# EAGLE design rgbstripe_msgeq7_pcb (EAGLE 9.6.2)
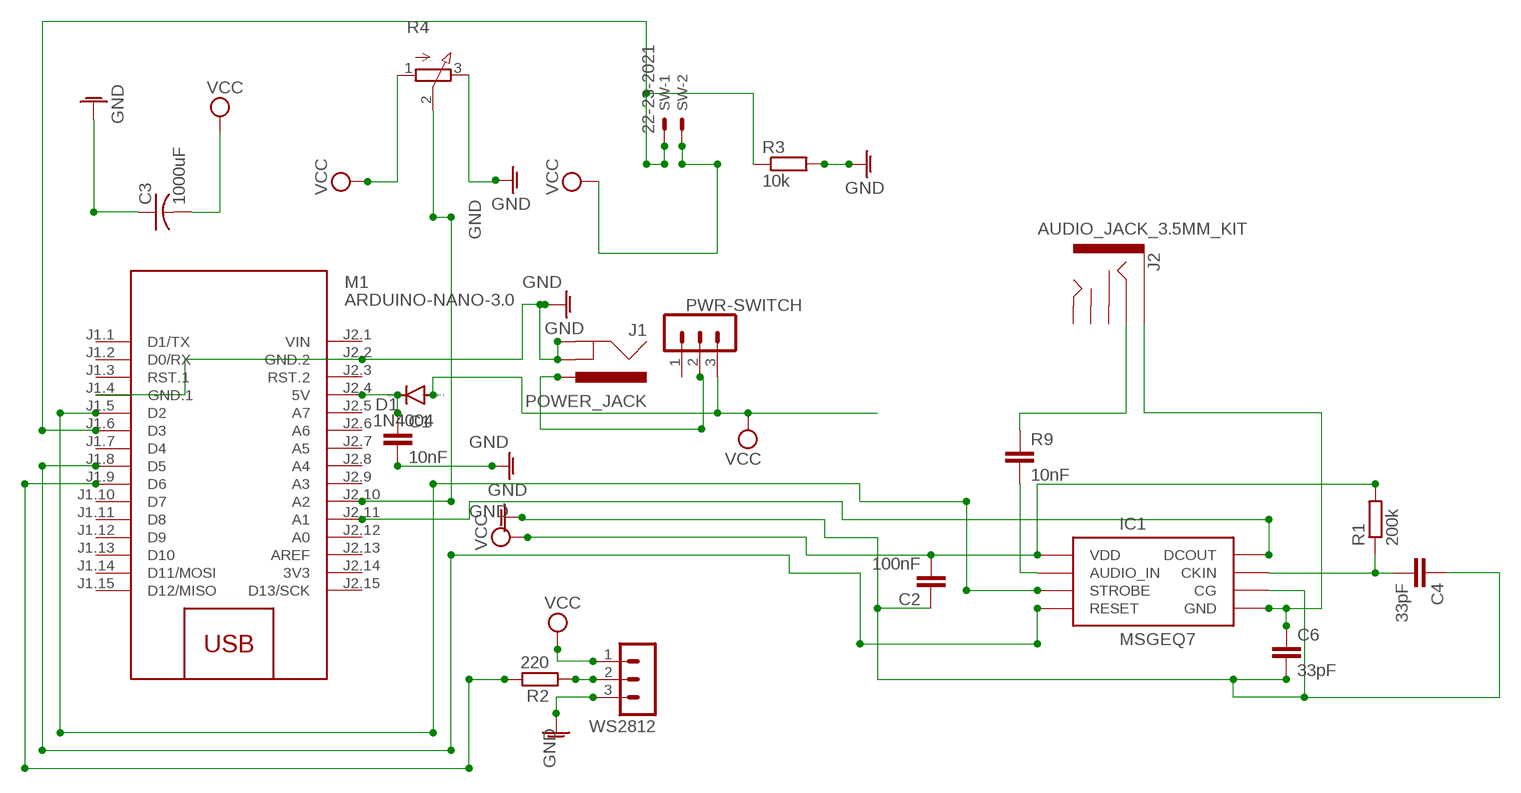
[diagram p0: schematic, sheet 1]

## Parts
C1  10nF  C-EU025-025X050  [C025-025X050]
C2  100nF  C-EU025-025X050  [C025-025X050]
C3  1000uF  C-US050-024X044  [C050-024X044]
C4  33pF  C-EU025-025X050  [C025-025X050]
C6  33pF  C-EU025-025X050  [C025-025X050]
D1  1N4004  [DO41-10]
IC1  MSGEQ7P  MSGEQ7DIL  [DIP08]
J1  POWER_JACK  [POWER_JACK_PTH]
J2  AUDIO_JACK_3.5MM_KIT  [AUDIO-JACK-KIT]
M1  ARDUINO-NANO-3.0  [ARDUINO-NANO-3.0]
PWR-SWITCH  MA03-1  [MA03-1]
R1  200k  R-EU_0204/5  [0204/5]
R2  220  R-EU_0204/5  [0204/5]
R3  10k  R-EU_0204/5  [0204/5]
R4  3RP/1610N  [3RP/1610N]
R9  10nF  C-EU025-025X050  [C025-025X050]
SW  22-23-2021  [22-23-2021]
WS2812  MA03-1  [MA03-1]

## Nets
GND: C1.2 C2.1 C3.1 C4.1 C6.2 IC1.6(CG) J1.GND J1.GNDBREAK M1.J1.4(GND.1) M1.J2.2(GND.2) R3.2 R4.3(E) WS2812.3
N$1: C1.1 D1.C M1.J2.4(5V)
N$2: IC1.7(RESET) M1.J1.8(D5)
N$3: IC1.3(DCOUT) M1.J2.11(A1)
N$8: IC1.4(STROBE) M1.J1.5(D2)
N$10: J2.RING R9.1
N$11: C4.2 IC1.8(CKIN) R1.1
N$12: C6.1 IC1.2(GND) J2.SLEEVE
N$13: IC1.5(AUDIO_IN) R9.2
N$14: M1.J1.9(D6) R2.2
N$15: M1.J2.10(A2) R4.2(S)
N$16: R2.1 WS2812.2
N$17: M1.J1.6(D3) R3.1 SW.1
N$19: J1.PWR PWR-SWITCH.2
VCC: C2.2 C3.2 D1.A IC1.1(VDD) PWR-SWITCH.3 R1.2 R4.1(A) SW.2 WS2812.1
Unconnected: J2.RSH J2.TIP J2.TSH M1.J1.1(D1/TX) M1.J1.2(D0/RX) M1.J1.3(RST.1) M1.J1.7(D4) M1.J1.10(D7) M1.J1.11(D8) M1.J1.12(D9) M1.J1.13(D10) M1.J1.14(D11/MOSI) M1.J1.15(D12/MISO) M1.J2.3(RST.2) M1.J2.5(A7) M1.J2.6(A6) M1.J2.7(A5) M1.J2.8(A4) M1.J2.9(A3) M1.J2.12(A0) M1.J2.13(AREF) M1.J2.15(D13/SCK) PWR-SWITCH.1

## Power pins joined to a net without a drawn wire
3V3: M1.J2.14(3V3)
VIN: M1.J2.1(VIN)

## Library data of the parts
C1 C2 C4 C6 R9 = resistor:C-EU: CAPACITOR, European symbol
C3 = resistor:C-US: CAPACITOR, American symbol
D1 = diode:1N4004: DIODE general purpose rectifier, 1 A
IC1 = SparkFun-IC-Special-Function:MSGEQ7: 7-band graphic equalizer This IC is for making a 7 band/channel audio spectrometer. There are two versions of this part. The DIP available on the storefront, and the SO used in product. Datasheet <https://www.sparkfun.com/datasheets/Components/General/MSGEQ7.pdf> SparkFun Products Storefront component: Graphic Equalizer Display Filter - MSGEQ7 <https://www.sparkfun.com/products/10468> (COM-10468) SparkFun Spectrum Shield <https://www.sparkfun.com/products/13116> (DEV-13116); PROD_ID: IC-12196
J1 = SparkFun-Connectors:POWER_JACK: Power Jack Connector This is the standard 5.5mm barrel jack for power. The PTH is the most common, proven, reliable, footprint. The Slot footprint only works if the mill layer is transmitted to the PCB fab house so be warned. Here are the connectors we sell at SparkFun: DC Barrel Power Jack/Connector <https://www.sparkfun.com/products/119> (PRT-00119) DC Barrel Power Jack/Connector (SMD) <https://www.sparkfun.com/products/12748> (PRT-12748) DC Barrel Jack Adapter - Breadboard Compatible <https://www.sparkfun.com/products/10811> (PRT-10811) It is used on this SparkFun product (and many, many others): SparkFun RedBoard - Programmed with Arduino <https://www.sparkfun.com/products/12757> (DEV-12757) Also, if you need a mating power supply or connector, please check these out: Wall Adapter Power Supply - 9VDC 650mA <https://www.sparkfun.com/products/298> (TOL-00298) DC Barrel Jack Adapter - Male <https://www.sparkfun.com/products/10287> (PRT-10287); PROD_ID: CONN-08197
J2 = SparkFun-Connectors:AUDIO_JACK_3.5MM: Audio Jack 3.5mm variants of PTH and SMT stereo audio jack with bypass switches. SparkFun Products: SparkFun SparkPunk Sound Kit <[https://www.sparkfun.com/products/11177]> - PTH MP3 Trigger <https://www.sparkfun.com/products/13720> -3.5mm SMD SparkFun PicoBoard <https://www.sparkfun.com/products/11888>- 2.5mm SMD; PROD_ID: CONN-08774; SF_ID: PRT-08032
M1 = diy-modules-nano:ARDUINO-NANO-3.0: Arduino Nano 3.0 and compatible devices More details available here: https://www.arduino.cc/en/Main/ArduinoBoardNano Click here to find device on ebay.com <http://www.ebay.com/sch/arduino+nano>
PWR-SWITCH WS2812 = con-lstb:MA03-1: PIN HEADER; OC_FARNELL: unknown; OC_NEWARK: unknown
R1-R3 = resistor:R-EU_: RESISTOR, European symbol
R4 = pot:3RP/1610N: 16mm Potentiometer one level Source: http://www.alphapotentiometers.net/html/16mm_pot_2.html
SW = con-molex:22-23-2021: .100" (2.54mm) Center Header - 2 Pin; MF: MOLEX; MPN: 22-23-2021; OC_FARNELL: 1462926; OC_NEWARK: 25C3832

## Board
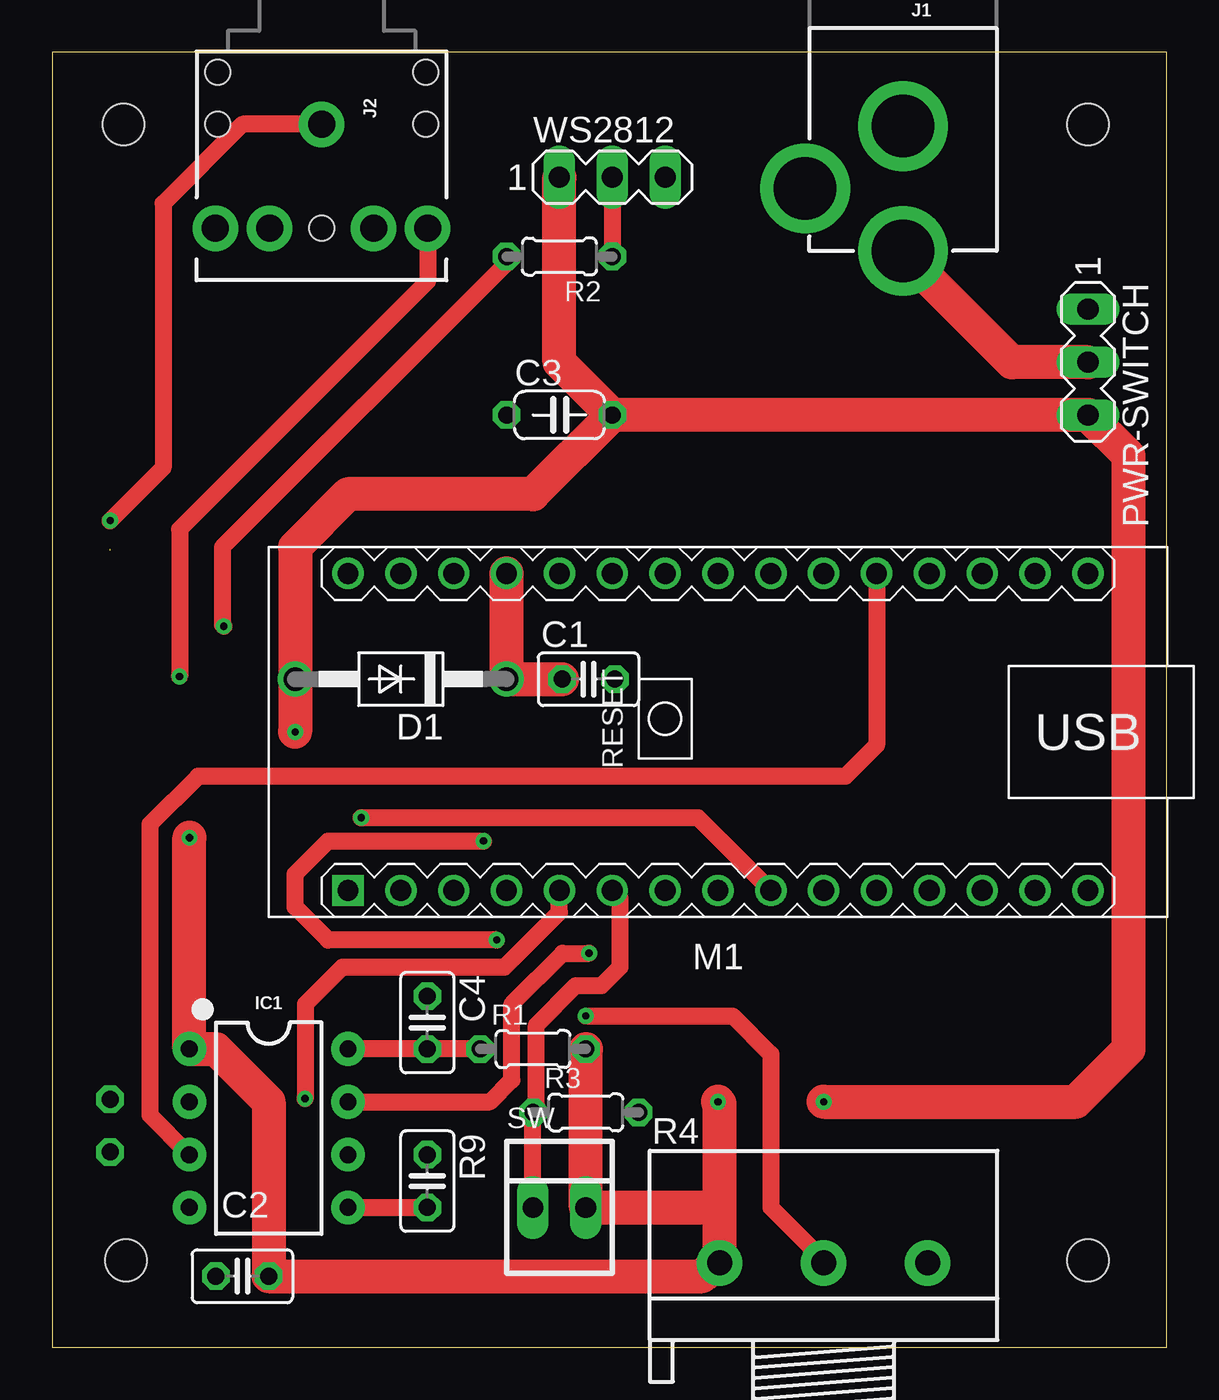
[diagram p1: board, top side]
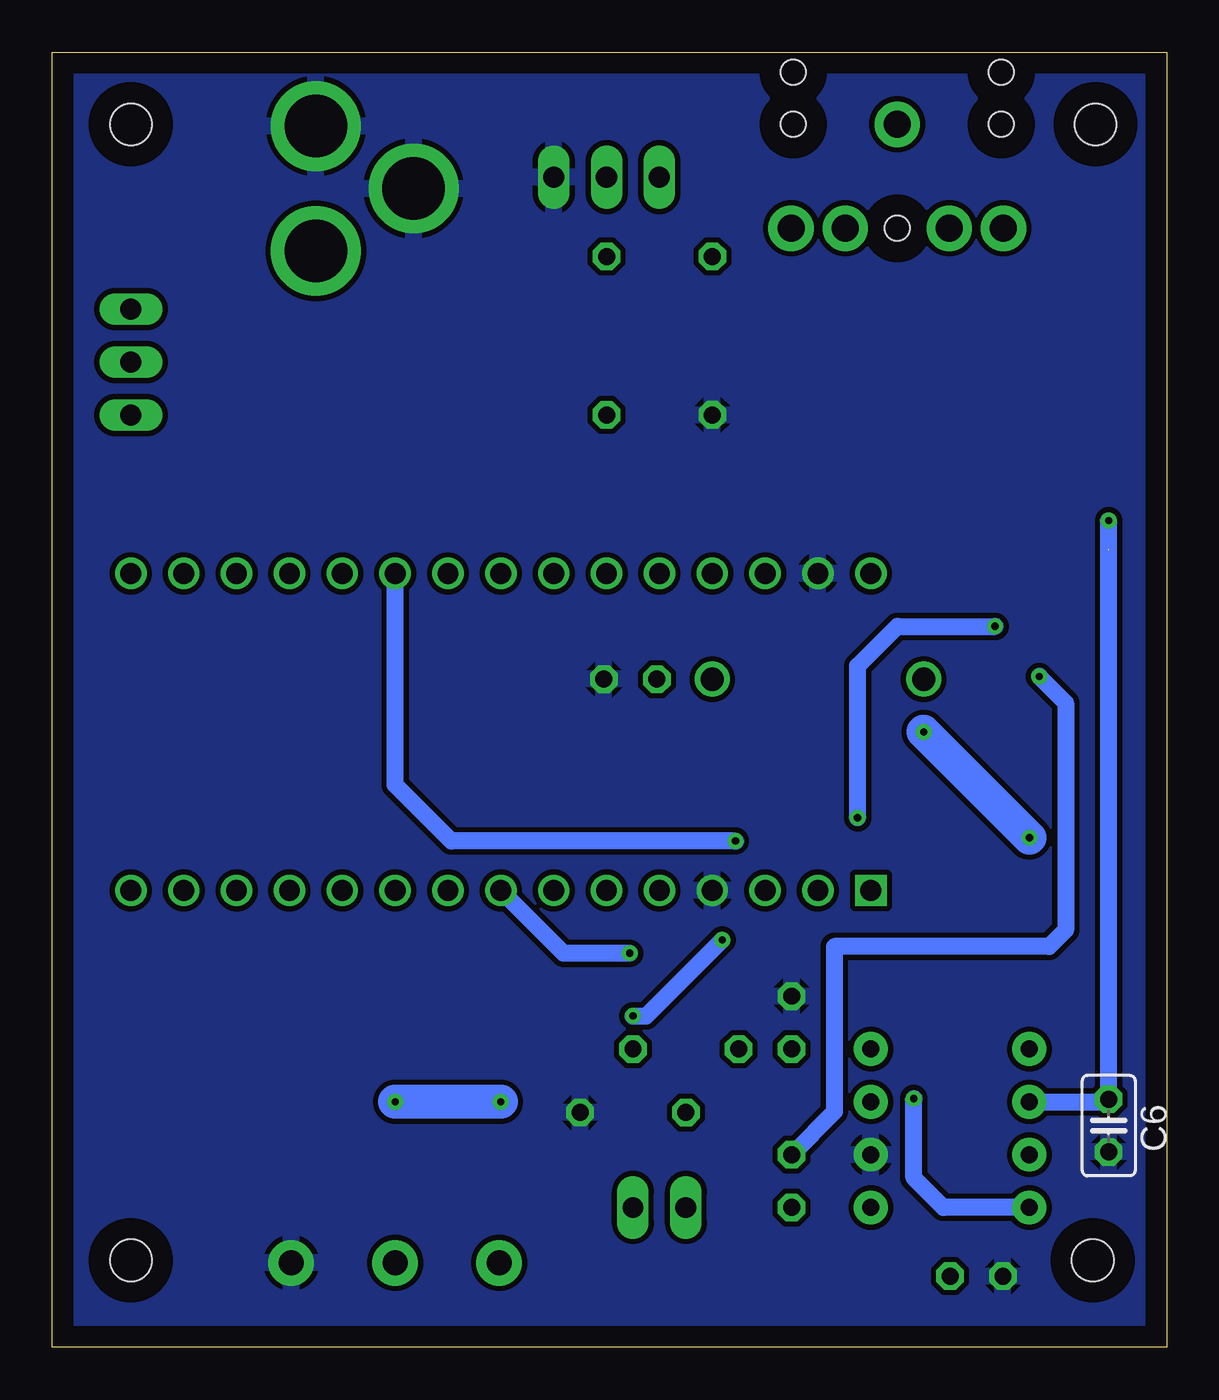
[diagram p2: board, bottom side, seen from below]

Size 53.57 x 62.28 mm. Coordinates in mm from the lower left corner, seen from the top.
Outline: 0,0 53.57,0 53.57,62.28 0,62.28 0,0
Copper layers (1*16): Top 0.035mm / dielectric 1.5mm / Bottom 0.035mm
Design rules "default *": minimum track width 32mil, minimum drill 0.35mm, track to track 10mil, track to pad 10mil, pad to pad 6mil, via to via 6mil, smd to smd 6mil, copper to edge 40mil, drill to drill 6mil, minimum pad ring 10mil, minimum via ring 8mil, stop-mask expansion 4mil, vias tented up to drill 0mil, thermal gap 10mil
Holes 2 mm at 3.43,58.8 49.78,4.19 3.56,4.19 49.78,58.8

### Footprints (pad centres in the part's own frame; a part is rotated, then mirrored left to right if it is on the bottom)
C025-025X050 = drill 0.813 octagon: 1 -1.27,0; 2 1.27,0
C050-024X044 = drill 0.813 octagon: 1 -2.54,0; 2 2.54,0
DO41-10 = drill 1.118: A 5.08,0; C -5.08,0
DIP08 = drill 0.813 pad 1.626: 1 -3.81,-3.81; 2 -1.27,-3.81; 3 1.27,-3.81; 4 3.81,-3.81; 5 3.81,3.81; 6 1.27,3.81; 7 -1.27,3.81; 8 -3.81,3.81
POWER_JACK_PTH = drill 2.997 pad 4.318: GND 0,7.7; GNDBREAK 4.7,10.7; PWR 0,13.7
AUDIO-JACK-KIT = drill 1.3 pad 2.184: RING 5,5.1; RSH 5,2.5; SLEEVE 0,0; TIP 5,-5.1; TSH 5,-2.5 | hole 1.2: 0,5; -2.5,5; -2.5,-5; 0,-5; 5,0
ARDUINO-NANO-3.0 = drill 1 square: J1.1 17.78,7.62 | drill 1: J1.2 15.24,7.62; J1.3 12.7,7.62; J1.4 10.16,7.62; J1.5 7.62,7.62; J1.6 5.08,7.62; J1.7 2.54,7.62; J1.8 0,7.62; J1.9 -2.54,7.62; J1.10 -5.08,7.62; J1.11 -7.62,7.62; J1.12 -10.16,7.62; J1.13 -12.7,7.62; J1.14 -15.24,7.62; J1.15 -17.78,7.62; J2.1 17.78,-7.62; J2.2 15.24,-7.62; J2.3 12.7,-7.62; J2.4 10.16,-7.62; J2.5 7.62,-7.62; J2.6 5.08,-7.62; J2.7 2.54,-7.62; J2.8 0,-7.62; J2.9 -2.54,-7.62; J2.10 -5.08,-7.62; J2.11 -7.62,-7.62; J2.12 -10.16,-7.62; J2.13 -12.7,-7.62; J2.14 -15.24,-7.62; J2.15 -17.78,-7.62
MA03-1 = drill 1.016 long: 1 -2.54,0; 2 0,0; 3 2.54,0
0204/5 = drill 0.813 octagon: 1 -2.54,0; 2 2.54,0
3RP/1610N = drill 1.2 pad 2.184: 1 -5,0; 2 0,0; 3 5,0
22-23-2021 = drill 1 long: 1 -1.27,0; 2 1.27,0

### Placement (x,y rotation side)
C1  25.78,32.13 0 top
C2  9.14,3.43 0 top
C3  24.38,44.83 0 top
C4  18.03,15.62 270 top
C6  2.79,10.67 270 bottom
D1  16.76,32.13 180 top
IC1  10.41,10.54 270 top
J1  40.89,66.42 180 top
J2  12.95,58.8 270 top
M1  32,29.59 180 top
PWR-SWITCH  49.78,47.37 270 top
R1  23.11,14.35 0 top
R2  24.38,52.45 180 top
R3  25.65,11.3 0 top
R4  37.08,4.06 0 top
R9  18.03,8 270 top
SW  24.38,6.73 0 top
WS2812  26.92,56.26 0 top

### Tracks (layer width: path | path; a pad name or v marks a point on that pad's centre or on a via)
GND
  pour Bottom: 53.59,62.61 53.59,-0.89 -6.1,-0.89 -6.1,62.61
  pour Bottom: 0.25,62.61 0.25,-0.89 53.59,-0.89 53.59,62.61
N$1
  Top 1.626: M1.J2.4 D1.C C1.1
N$2  (via drill 0.35)
  Top 0.813: v25.81,18.95 24.54,18.95 22.1,16.51 22.1,12.86 21.05,11.81 IC1.7
  Bottom 0.813: M1.J1.8 28.99,18.95 v25.81,18.95
N$3
  Top 0.813: M1.J2.11 39.62,28.96 38.13,27.46 7.02,27.46 4.7,25.15 4.7,11.18 IC1.3
N$8  (via drill 0.35)
  Top 0.813: M1.J1.5 24.38,20.92 21.75,18.29 13.97,18.29 12.19,16.51 12.19,12 v12.16,11.97
  Bottom 0.813: v12.16,11.97 12.16,8.16 10.73,6.73 IC1.4
N$10  (via drill 0.35)
  Top 0.813: v6.13,32.26 6.13,39.34 18.05,51.26 J2.RING
  Bottom 0.813: R9.1 15.97,11.34 15.97,19.27 5.65,19.27 4.86,20.07 4.86,30.99 v6.13,32.26
N$11
  Top 0.813: R1.1 C4.2 IC1.8
N$12  (via drill 0.35)  (1 unrouted)
  Top 0.813: J2.SLEEVE 9.14,58.8 5.33,54.99 5.33,42.29 v2.79,39.75
  Bottom 0.813: 6.44,11.97 IC1.2 2.92,11.81 C6.1 2.79,38.31 | 2.79,38.37 v2.79,39.75
N$13
  Top 0.813: IC1.5 R9.2
N$14  (via drill 0.35)
  Top 0.813: v14.86,25.46 31.05,25.46 M1.J1.9 | R2.2 21.84,52.13 8.19,38.48 8.19,34.73 v8.25,34.67
  Bottom 0.813: v14.86,25.46 14.86,32.77 12.95,34.67 v8.25,34.67
N$15  (via drill 0.35)
  Top 0.813: v20.73,24.35 13.27,24.35 11.68,22.77 11.68,21.18 13.27,19.59 v21.37,19.59 | R4.2 37.08,4.19 | 37.08,4.19 37.08,4.67 | v25.65,15.94 32.7,15.94 34.54,14.1 34.54,6.73 37.08,4.19
  Bottom 0.813: M1.J2.10 37.08,27.05 34.39,24.35 v20.73,24.35 | v21.37,19.59 25.02,15.94 v25.65,15.94
N$16
  Top 0.813: WS2812.2 R2.1
N$17
  Top 0.813: SW.1 R3.1 23.27,11.62 23.27,15.49 25.18,17.4 26.42,17.4 27.3,18.29 27.3,21.59 M1.J1.6
N$19
  Top 0.813: 40.89,52.61 J1.PWR
  Top 1.626: PWR-SWITCH.2 46.13,47.37 40.89,52.61
VCC  (via drill 0.35)
  Top 0.813: 32,4.19 R4.1 | 25.49,6.41 SW.2 | 11.52,32.45 D1.A
  Top 0.914: v32,11.81 32,6.73 32,4.19
  Top 1.626: C3.2 PWR-SWITCH.3 51.74,42.87 51.74,14.35 49.2,11.81 v37.08,11.81 | C3.2 24.38,47.37 WS2812.1 | C3.2 23.11,41.02 14.22,41.02 11.68,38.48 D1.A v11.68,29.59 | 32,4.19 31.24,3.43 C2.2 10.41,11.81 7.87,14.35 IC1.1 v6.6,24.51 | R4.1 32.08,11.73 v32,11.81 | 32,6.73 SW.2 R1.2
  Bottom 1.626: v32,11.81 v37.08,11.81 | v6.6,24.51 v11.68,29.59